# EAGLE design logic (EAGLE 9.2.2)
Assembly variants: BASIC
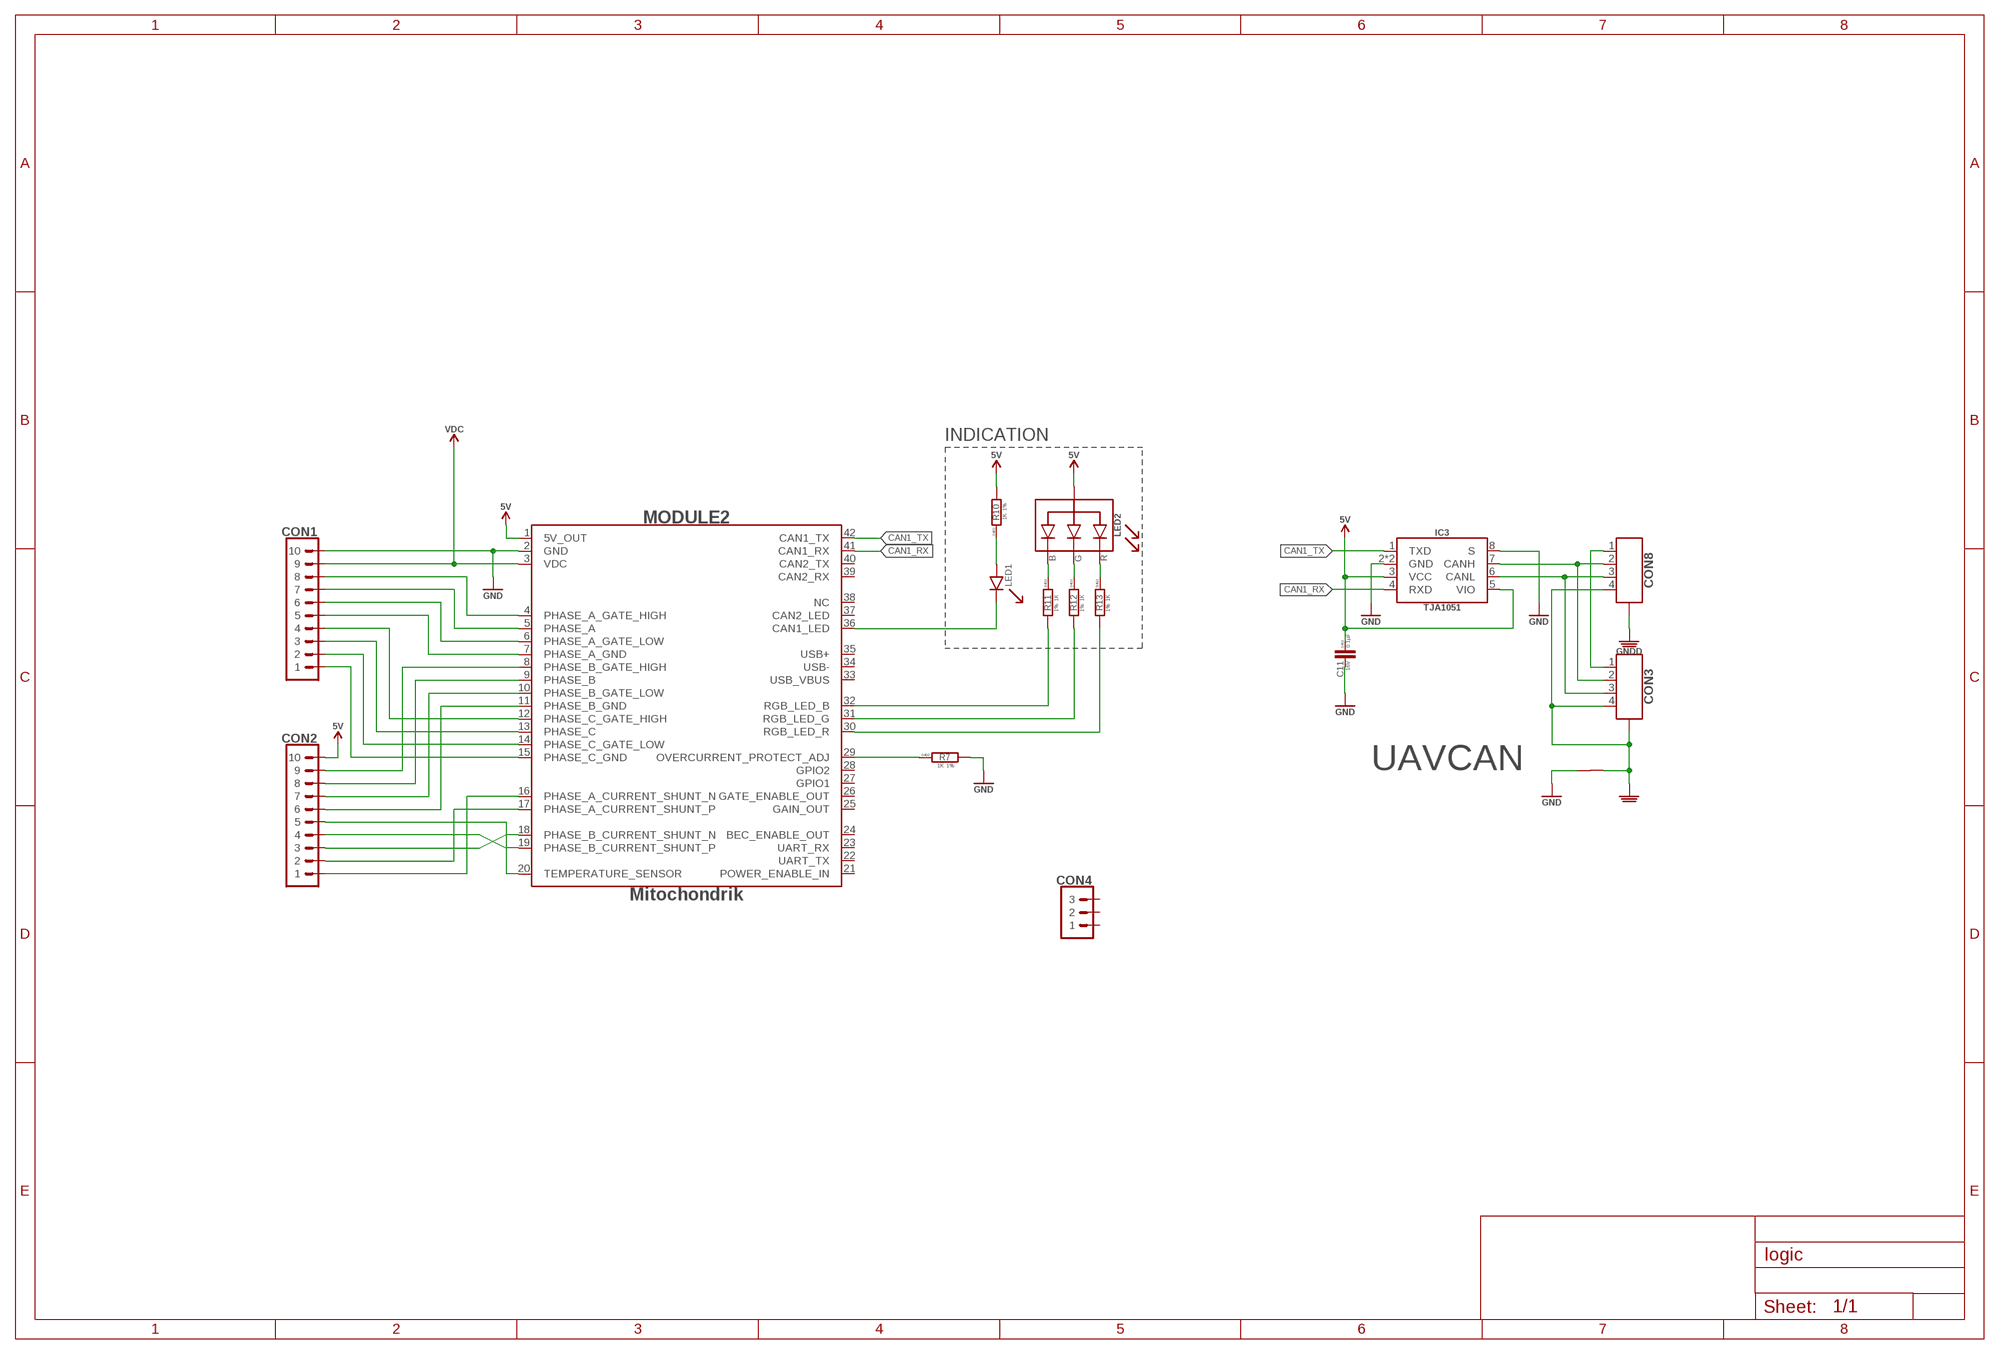
[diagram p0: schematic, sheet 1]

## Parts
C11  0.1µF  0.1µF-16V_10%_X7R-0402  [C0402]
CON1  PINHEAD_1X10-2  [1X10-PTH_2]
CON2  PINHEAD_1X10-2  [1X10-PTH_2]
CON3  CON-4P-JST_GH-RA  [JST_GH-4P-RA]
CON4  PINHEAD_1X03-2.54-RA  [1X03-PTH-2.54-RA]
CON8  CON-4P-JST_GH-RA  [JST_GH-4P-RA]
IC3  TJA1051  [SOT782-1]
LED1  GREEN  LED-GREEN-0402  [0402_LED]
LED2  LTST-C19HE1WT  [LITE_ON_RGB_LED]
MODULE2  MITOHONDRIQUE-TH  [MITOHONDRIQUE]
R7  1K  1K-1%-0402  [R0402]
R10  1K  1K-1%-0402  [R0402]
R11  1K  1K-1%-0402  [R0402]
R12  1K  1K-1%-0402  [R0402]
R13  1K  1K-1%-0402  [R0402]
U$2  CONNECTION  [CONNECTION]

## Nets
CAN1_LED: LED1.C MODULE2.36(CAN1_LED)
CAN1_RX: IC3.4(RXD) MODULE2.41(CAN1_RX)
CAN1_TX: IC3.1(TXD) MODULE2.42(CAN1_TX)
GND: C11.2 CON1.10 IC3.2(GND) IC3.8(S) IC3.PAD(GND) MODULE2.2(GND) R7.2 U$2.P$1
GNDD: CON3.4 CON3.M$0(GND) CON3.M$1(GND) CON8.4 CON8.M$0(GND) CON8.M$1(GND) U$2.P$2
LED_GREEN: MODULE2.31(RGB_LED_G) R12.2
LED_RED: MODULE2.30(RGB_LED_R) R13.2
N$1: CON2.3 MODULE2.18(PHASE_B_CURRENT_SHUNT_N)
N$2: CON2.2 MODULE2.17(PHASE_A_CURRENT_SHUNT_P)
N$3: CON2.1 MODULE2.16(PHASE_A_CURRENT_SHUNT_N)
N$4: CON2.4 MODULE2.19(PHASE_B_CURRENT_SHUNT_P)
N$5: CON1.1 MODULE2.15(PHASE_C_GND)
N$6: MODULE2.32(RGB_LED_B) R11.2
N$7: LED1.A R10.1
N$18: MODULE2.29(OVERCURRENT_PROTECT_ADJ) R7.1
N$23: CON3.2 CON8.2 IC3.7(CANH)
N$28: CON3.1 CON8.1
N$35: CON3.3 CON8.3 IC3.6(CANL)
N$58: LED2.R R13.1
N$59: LED2.G R12.1
N$60: LED2.B R11.1
PHASE_A [HV]: CON1.7 MODULE2.5(PHASE_A)
PHASE_A_GATE_HIGH [HV]: CON1.8 MODULE2.4(PHASE_A_GATE_HIGH)
PHASE_A_GATE_LOW: CON1.6 MODULE2.6(PHASE_A_GATE_LOW)
PHASE_A_GND: CON1.5 MODULE2.7(PHASE_A_GND)
PHASE_B [HV]: CON1.3 MODULE2.13(PHASE_C)
PHASE_B_GATE_HIGH [HV]: CON1.4 MODULE2.12(PHASE_C_GATE_HIGH)
PHASE_B_GATE_LOW: CON1.2 MODULE2.14(PHASE_C_GATE_LOW)
PHASE_C [HV]: CON2.8 MODULE2.9(PHASE_B)
PHASE_C_GATE_HIGH [HV]: CON2.9 MODULE2.8(PHASE_B_GATE_HIGH)
PHASE_C_GATE_LOW: CON2.7 MODULE2.10(PHASE_B_GATE_LOW)
PHASE_C_GND: CON2.6 MODULE2.11(PHASE_B_GND)
TEMPERATURE_SENSOR: CON2.5 MODULE2.20(TEMPERATURE_SENSOR)
VDC [HV]: CON1.9 MODULE2.3(VDC)
VDD_5V: C11.1 CON2.10 IC3.3(VCC) IC3.5(VIO) LED2.+(A) MODULE2.1(5V_OUT) R10.2 ; supply symbol labelled 5V
Unconnected: CON4.1 CON4.2 CON4.3 MODULE2.21(POWER_ENABLE_IN) MODULE2.22(UART_TX) MODULE2.23(UART_RX) MODULE2.24(BEC_ENABLE_OUT) MODULE2.25(GAIN_OUT) MODULE2.26(GATE_ENABLE_OUT) MODULE2.27(GPIO1) MODULE2.28(GPIO2) MODULE2.33(USB_VBUS) MODULE2.34(USB-) MODULE2.35(USB+) MODULE2.37(CAN2_LED) MODULE2.38(NC) MODULE2.39(CAN2_RX) MODULE2.40(CAN2_TX)

## Notes on the sheet
- INDICATION
- UAVCAN

## Library data of the parts
C11 = C_digikey:0.1µF; DIGIKEY#: 490-3261-1-ND; MANF: Murata Electronics North America; MANF#: GRM155R71C104KA88D; OPERATING_TEMP: -55°C ~ 125°C; PACKAGE: 0402; TC: X7R; TOLERANCE: +-10%; VOLTAGE: 16V
CON1 CON2 = pinhead:PINHEAD_1X10
CON3 CON8 = Connectors:CON-4P: Connector Receptacle 4 Position 0.049" (1.25mm) Tin Surface Mount; DIGIKEY#: 455-1566-1-ND; MANF: JST Sales America Inc; MANF#: SM04B-GHS-TB(LF)(SN)
CON4 = pinhead:PINHEAD_1X03: pinheader 3P
IC3 = myxa_masterlib:TJA1051: 1/1 Transceiver Half CAN 8-HVSON (3x3); DIGIKEY#: 568-8686-2-ND; MANF: NXP Semiconductors; MANF#: TJA1051TK/3,118
LED1 = myxa_masterlib:LED; COLOR: GREEN; DIGIKEY#: 511-1652-1-ND; MANF: Rohm Semiconductor; MANF#: SML-P11MTT86
LED2 = myxa_masterlib:LTST-C19HE1WT; DIGIKEY#: 160-2162-1-ND; MANF: Lite-On Inc; MANF#: LTST-C19HE1WT
MODULE2 = zubax_modules:MITOHONDRIQUE; MANF: Zubax Robotics; MANF#: Mitochondrik
R7 R10-R13 = R_digikey:1K; DIGIKEY#: 311-1.00KLRCT-ND; MANF: Yageo; MANF#: RC0402FR-071KL; PACKAGE: 0402; TOLERANCE: 1%
U$2 = usb2can_master_lib:CONNECTION; BOM: EXCLUDE

## Net classes
1 HV: clearance 0.25 mm to class 0, clearance 0.25 mm

## Board
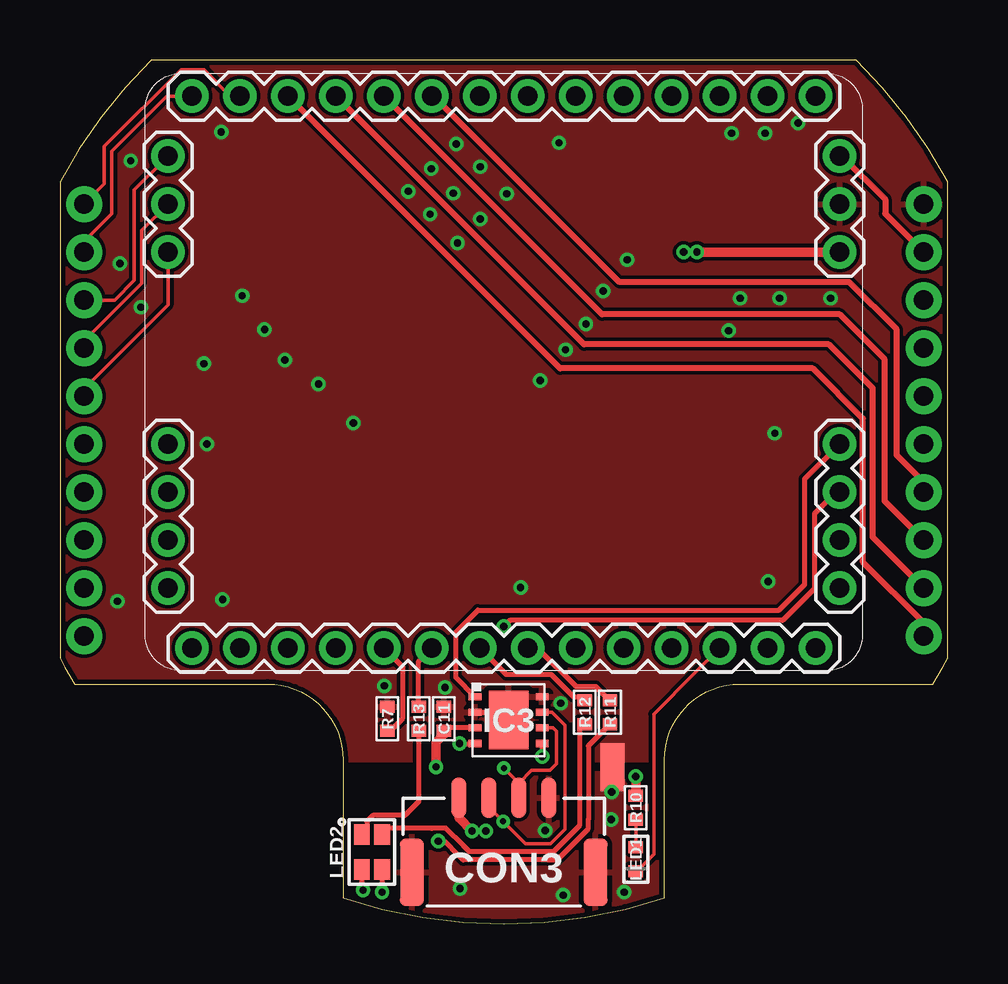
[diagram p1: board, top side]
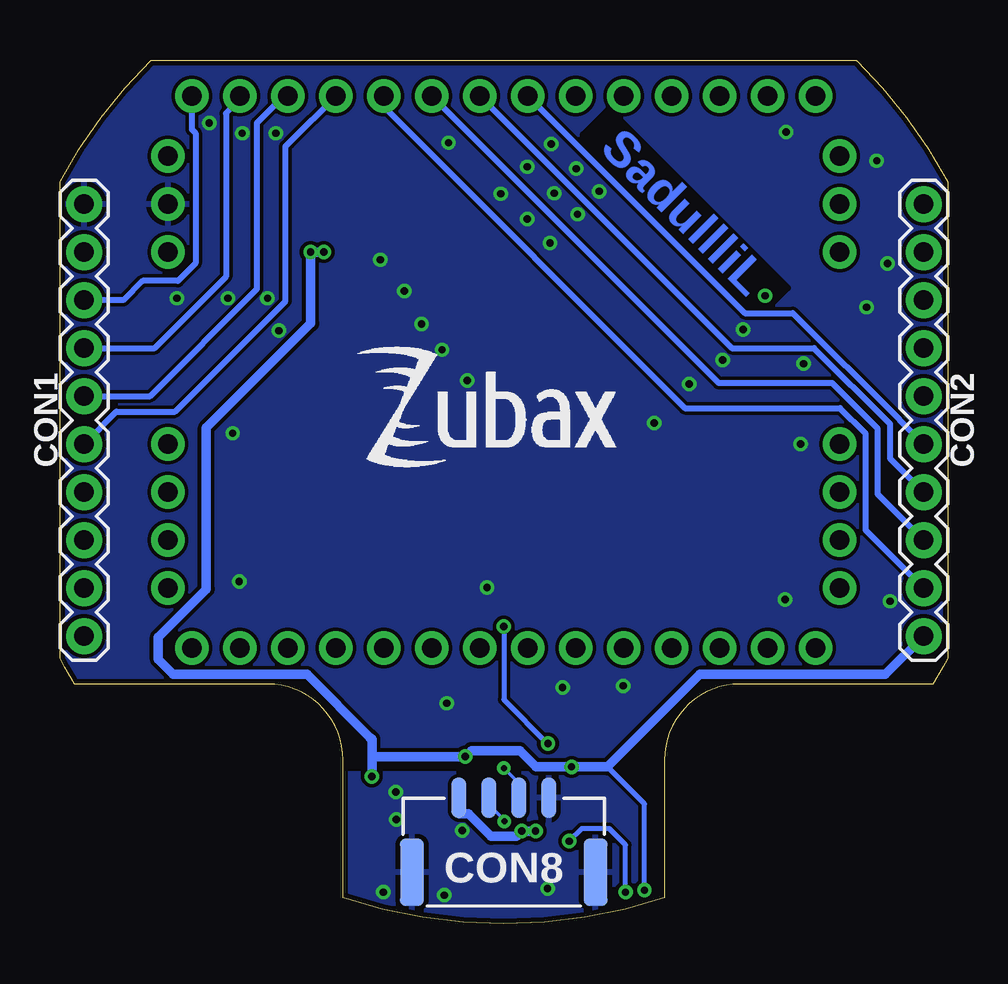
[diagram p2: board, bottom side, seen from below]

Size 37 x 36 mm. Coordinates in mm from the lower left corner, seen from the top.
Outline: 0,30.94 0,11.06 arc3 0.61,10 8.65,10 arc-90 11.8,6.85 11.8,1.1 arc37 25.2,1.1 25.2,6.85 arc-90 28.35,10 36.39,10 arc3 37,11.06 37,30.94 arc17 33.2,36 3.8,36 arc17 0,30.94
Copper layers (1*16): Top 0.035mm / dielectric 0.5mm / Bottom 0.035mm
Design rules "myxa *": minimum track width 0.15mm, minimum drill 0.2mm, track to track 0.15mm, track to pad 0.15mm, pad to pad 0.15mm, via to via 0.15mm, smd to smd 0.15mm, copper to edge 0.2mm, drill to drill 0.2mm, minimum pad ring 0.125mm, minimum via ring 0.125mm, stop-mask expansion 1mil, vias tented up to drill 0.31mm, thermal gap 8mil
tRestrict: 2 lines

### Footprints (pad centres in the part's own frame; a part is rotated, then mirrored left to right if it is on the bottom)
C0402 = smd 0.5 x 0.6: 1 -0.5,0; 2 0.5,0
1X10-PTH_2 = drill 0.8 pad 1.5: 1 -9,0; 2 -7,0; 3 -5,0; 4 -3,0; 5 -1,0; 6 1,0; 7 3,0; 8 5,0; 9 7,0; 10 9,0
JST_GH-4P-RA = smd 0.6 x 1.7: 1 1.875,-2.91; 2 0.625,-2.91; 3 -0.625,-2.91; 4 -1.875,-2.91 | smd 1 x 2.8: M$0 -3.825,0.19; M$1 3.825,0.19
SOT782-1 = smd 0.525 x 0.3: 1 -1.4,0.975; 2 -1.4,0.325; 3 -1.4,-0.325; 4 -1.4,-0.975; 5 1.4,-0.975; 6 1.4,-0.325; 7 1.4,0.325; 8 1.4,0.975 | smd 1.65 x 2.45: PAD 0,0
0402_LED = smd 0.5 x 0.6: A 0.5,0; C -0.5,0
LITE_ON_RGB_LED = smd 0.65 x 0.85: + -0.425,-0.725; B 0.425,-0.725; G 0.425,0.725; R -0.425,0.725
MITOHONDRIQUE = drill 0.8 pad 1.4: 1 -5,14; 2 -7,14; 3 -9,14; 4 -11.5,13; 5 -11.5,11; 6 -11.5,9; 7 -11.5,7; 8 -11.5,5; 9 -11.5,3; 10 -11.5,1; 11 -11.5,-1; 12 -11.5,-3; 13 -11.5,-5; 14 -11.5,-7; 15 -11.5,-9; 16 -11.5,-11; 17 -11.5,-13; 18 -9,-14; 19 -7,-14; 20 -5,-14; 21 3,-14; 22 5,-14; 23 7,-14; 24 9,-14; 25 11.5,-13; 26 11.5,-11; 27 11.5,-9; 28 11.5,-7; 29 11.5,-5; 30 11.5,-3; 31 11.5,-1; 32 11.5,1; 33 11.5,3; 34 11.5,5; 35 11.5,7; 36 11.5,9; 37 11.5,11; 38 11.5,13; 39 9,14; 40 7,14; 41 5,14; 42 3,14
R0402 = smd 0.5 x 0.6: 1 -0.5,0; 2 0.5,0
CONNECTION = smd 1 x 1: P$1 -0.5,0; P$2 0.5,0

### Placement (x,y rotation side)
C11  16,8.55 90 top
CON1  36,21 90 bottom
CON2  1,21 270 bottom
CON3  18.5,2.35 180 top
CON8  18.5,2.35 180 bottom
IC3  18.7,8.5 0 top
LED1  24,2.7 90 top
LED2  13,3 0 top
MODULE2  18.5,23 270 top
R7  13.65,8.55 90 top
R10  24,4.85 90 top
R11  22.93,8.82 90 top
R12  21.88,8.82 90 top
R13  14.95,8.55 90 top
U$1  [ZUBAX_LOGO_5X10]  24.68,18.85 0 bottom
U$2  23.02,6.52 270 top

### Tracks (layer width: path | path; a pad name or v marks a point on that pad's centre or on a via)
CAN1_LED
  Top 0.15: MODULE2.36 26.48,10.47 24.75,8.75 24.75,2.9 24.05,2.2 LED1.C
CAN1_RX  (via drill 0.3 pad 0.6)
  Top 0.2: MODULE2.41 32.35,18 31.45,17.1 31.45,13.97 30.12,12.65 18.75,12.65 v18.5,12.4 | v16.66,7.52 IC3.4
  Bottom 0.2: v18.5,12.4 18.5,9.35 v16.67,7.52 v16.66,7.52
CAN1_TX
  Top 0.2: IC3.1 16.5,10.27 16.5,12.15 17.43,13.07 29.98,13.07 31.05,14.15 31.05,18.55 MODULE2.42
GND  (via drill 0.3 pad 0.6)
  Top 0.2: IC3.2 18.38,8.82 IC3.PAD
  other vias: 20.8,32.55 13.53,9.92 16.05,9.85 22.65,26.37 18.62,30.42 17.52,29.37 16.57,28.37 10.78,22.5 9.38,23.5 15.43,29.57 16.4,30.45 17.52,31.55 16.52,32.5 15.47,31.47 14.53,30.52 8.53,24.77 6,23.35 12.22,20.87 6.78,13.52 19.2,14.02 29.52,14.27 29.8,20.45 28.35,26.07 27.88,24.72 30,26.07 32.12,26.07 29.4,32.95 28,32.95 30.77,33.37 21.93,25 21.07,23.92 20.02,22.65 23.65,27.67 7.6,26.17 3.38,25.7 2.5,27.52 2.95,31.8 6.72,33 6.12,20 2.4,13.45 20.88,9.2
  pour Bottom: 39.5,42 -2.5,42 -2.5,6.8 39.5,6.8
  pour Top: -2.5,42 39.5,42 39.5,6.8 -2.5,6.8
GNDD  (via drill 0.3 pad 0.6)
  other vias: 22.98,4.35 16.68,1.47 23.52,1.32 20.98,1.2 23,5.5 20.23,3.9
  pour Top: 12,6.27 25,6.27 25,0 12,0
  pour Bottom: 25,6.27 12,6.27 12,0 25,0
LED_GREEN
  Top 0.2: MODULE2.31 18.6,10.4 20.48,10.4 21.4,9.47 21.73,9.47 R12.2
LED_RED
  Top 0.2: R13.2 14.95,10.95 MODULE2.30
N$1
  Top 0.15: MODULE2.18 3.1,30.6 3.1,26.82 2.28,26 CON2.3
N$2
  Top 0.15: MODULE2.17 4.45,34.5 2.15,32.2 2.15,29.6 1,28.45 CON2.2
N$3
  Top 0.15: MODULE2.16 7.1,34.5 6,35.6 5.05,35.6 1.85,32.4 1.85,30.85 CON2.1
N$4
  Top 0.15: CON2.4 1,24.3 3.4,26.7 3.4,28.9 MODULE2.19
N$5
  Top 0.25: CON1.1 36,12.55 33.48,15.07 33.48,21.05 31.38,23.15 20.85,23.15 MODULE2.15
N$6
  Top 0.2: MODULE2.32 19.9,11.5 21.5,9.9 22.32,9.9 22.9,9.32 R11.2
N$7
  Top 0.15: LED1.A R10.1
N$18
  Top 0.2: R7.1 13.78,8.05 14.3,8.57 14.3,10.7 MODULE2.29
N$23  (via drill 0.25 pad 0.55)
  Top 0.15: CON3.2 17.88,4.86 v18.46,4.27 v18.48,4.27 18.57,4.17 19.4,3.35 20.45,3.35 21.05,3.95 21.05,7.17 21.05,8.27 20.5,8.82 IC3.7
  Bottom 0.15: CON8.2 19.12,4.97 18.48,4.32 v18.48,4.27
N$28  (via drill 0.3 pad 0.6)
  Top 0.4: CON3.1 16.62,4.42 v17.18,3.87
  Bottom 0.4: v17.18,3.87 v17.75,3.87 17.98,3.65 19.02,3.65 19.98,4.6 20.38,4.6 CON8.1
N$35  (via drill 0.25 pad 0.55)
  Top 0.15: CON3.3 19.12,5.47 19.12,5.87 | 19.12,5.87 v18.5,6.5 | IC3.6 20.55,8.17 20.7,8.02 20.7,6.67 20.43,6.4 19.65,6.4 19.12,5.87
  Bottom 0.15: CON8.3 17.88,5.87 v18.5,6.5
N$58
  Top 0.2: R13.1 14.95,5.1 14.38,4.52 13.05,4.52 12.8,4.27 12.8,3.95 LED2.R
N$59
  Top 0.2: R12.1 21.68,8.12 21.68,4.11 20.59,3.02 17.05,3.02 16.81,3.26 16.07,4 15.53,4 15.45,4 13.45,4 13.45,3.75 LED2.G
N$60  (via drill 0.3 pad 0.6)
  Top 0.2: R11.1 22.02,7.42 22.02,4.35 22.02,3.97 20.73,2.67 20.35,2.67 16.8,2.67 16.61,2.87 16.6,2.87 16.02,3.45 v15.78,3.45 | LED2.B v13.43,1.32
  Bottom 0.2: v13.43,1.32 13.43,3.3 14.1,3.97 15.25,3.97 v15.78,3.45
PHASE_A
  Bottom 0.25: CON1.7 33.05,24 30.07,26.97 30.07,33.77 29.5,34.35 MODULE2.5
PHASE_A_GATE_HIGH
  Bottom 0.25: CON1.8 34.35,26 33.55,26.8 32.08,26.8 31.35,27.52 31.35,32.95 31.5,33.1 MODULE2.4
PHASE_A_GATE_LOW
  Bottom 0.25: CON1.6 33.25,22 28.8,26.45 28.8,33.37 27.68,34.5 MODULE2.6
PHASE_A_GND
  Bottom 0.25: MODULE2.7 27.45,32.55 27.6,32.4 27.6,25.95 32.2,21.35 34.65,21.35 CON1.5
PHASE_B
  Top 0.25: CON1.3 34.38,17.62 34.38,23.52 32.5,25.4 22.6,25.4 MODULE2.13
PHASE_B_GATE_HIGH
  Top 0.25: CON1.4 36,18.41 34.88,19.53 34.88,24.77 32.9,26.75 23.32,26.75 15.57,34.5 MODULE2.12
PHASE_B_GATE_LOW
  Top 0.25: CON1.2 33.88,16.12 33.88,22.32 32.05,24.15 21.85,24.15 MODULE2.14
PHASE_C
  Bottom 0.25: MODULE2.9 9.55,22.55 4.82,22.55 2.93,20.65 2.93,17.92 CON2.8
PHASE_C_GATE_HIGH
  Bottom 0.25: MODULE2.8 23.5,34.05 10.95,21.5 4.48,21.5 3.43,20.44 3.43,16.42 CON2.9
PHASE_C_GATE_LOW
  Bottom 0.25: MODULE2.10 9,24 5.56,24 2.4,20.83 2.4,19.4 CON2.7
PHASE_C_GND
  Bottom 0.25: MODULE2.11 8.45,25.45 6.45,25.45 2,21 | 2,21 | 2,21 CON2.6
TEMPERATURE_SENSOR
  Top 0.15: MODULE2.20 4.5,25.8 1,22.3 CON2.5
VDC
  Top 0.25: MODULE2.3 32.6,32 34.4,30.2 34.4,29.6 CON1.9
VDD_5V  (via drill 0.3 pad 0.6)
  Top 0.2: IC3.3 16.12,8.17 C11.1 | IC3.5 v20.1,6.97 | LED2.+ 12.57,1.47 v12.63,1.41
  Top 0.4: MODULE2.1 v26.55,28 | R10.2 v24,6.15 | C11.1 16,7.9 15.68,7.57 v15.68,6.55
  Bottom 0.2: v12.63,1.41 12.63,5.01 14.18,6.55
  Bottom 0.4: v26,28 v26.55,28 26.55,25.02 30.9,20.67 30.9,13.95 32.9,11.95 32.9,11.02 32.28,10.4 26.7,10.4 24.09,7.79 24,7.7 24,7.05 | CON2.10 2.6,10.4 10.32,10.4 14.18,6.55 v15.68,6.55 17.15,6.55 17.82,7.22 19.85,7.22 v20.1,6.97 23.93,6.97 24,7.05 | v24,6.15 24,7.05

### Text on the board
Bottom: SadullliL
Reference: PHASE_A_SHUNT_P | PHASE_A_SHUNT_N | PHASE_C_GND | PHASE_C_GATE_LOW | PHASE_C | PHASE_C_GATE_HIGH | PHASE_B_GND | PHASE_B_GATE_LOW | PHASE_B | PHASE_B_GATE_HIGH | PHASE_A_GND | PHASE_A_GATE_LOW | PHASE_A | PHASE_A_GATE_HIGH | PHASE_B_SHUNT_N | VDC | PHASE_B_SHUNT_P | GND | TEMPERATURE | 5V